# Altium schematic sheet jtagio.SchDoc: JTAG I/O
size A; Engineer: A. Peck; Organization: UCLA High Energy Physics; DocumentNumber: 8; Revision: 3.0; SheetNumber: 8; SheetTotal: 15; Project: LCT Comparator Tester
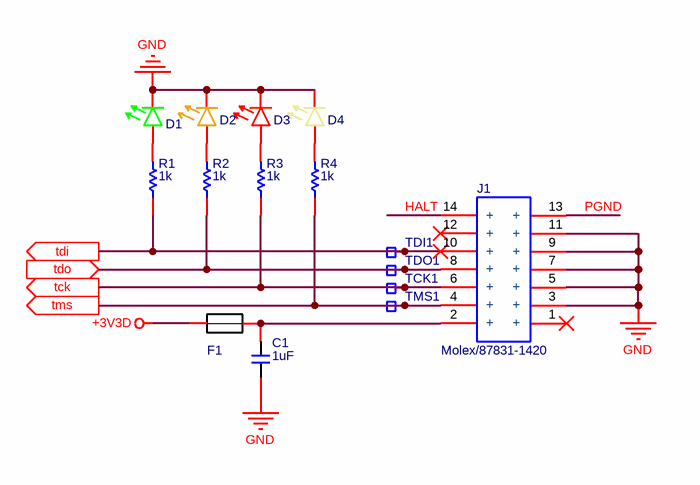
[diagram p0: jtagio.SchDoc]

## Parts
C1  1uF  [C0603]
D1  LITEON/LTST-C191KGKT  [LED0603]  (value not drawn)
D2  Vishay/TLMO1000-GS08  [LED0603]  (value not drawn)
D3  Vishay/TLMS1000-GS08  [LED0603]  (value not drawn)
D4  Vishay/TLMY1000-GS08  [LED0603]  (value not drawn)
F1  Littelfuse/1206L  [R1206]  (value not drawn)
J1  Molex/87831-1420  [Molex Milligrid 7x2]
R1  1k  [R0603]
R2  1k  [R0603]
R3  1k  [R0603]
R4  1k  [R0603]
TCK1  TP  [TP]  (value not drawn)  (no BOM)
TDI1  TP  [TP]  (value not drawn)  (no BOM)
TDO1  TP  [TP]  (value not drawn)  (no BOM)
TMS1  TP  [TP]  (value not drawn)  (no BOM)

## Ports
tck (out), tdi (out), tdo (in), tms (out)

## Nets
+3V3D: F1.1
GND: C1.2 D1.C D2.C D3.C D4.C J1.3(+) J1.5(+) J1.7(+) J1.9(+) J1.11(+)
HALT: J1.14(+)
PGND: J1.13(+)
tck: J1.6(+) R3.1 TCK1.1 ; port tck
tdi: J1.10(+) R1.1 TDI1.1 ; port tdi
tdo: J1.8(+) R2.1 TDO1.1 ; port tdo
tms: J1.4(+) R4.1 TMS1.1 ; port tms
NetC1_1: C1.1 F1.2 J1.2(+)
NetD1_A: D1.A R1.2
NetD2_A: D2.A R2.2
NetD3_A: D3.A R3.2
NetD4_A: D4.A R4.2

Not connected (* = marked no-connect by the designer): J1 1(+)* 12(+)*

## Notes on the sheet
- Date:
- Rev:
- of
- Sheet

## Library data of the parts
C1 = Murata/GRM188R61E105KA12D: CAP-CER, 2, 1.0uF, 10%, 25V, 0603; Manufacturer: Murata Electronics North America; Capacitance: 1µF; Temperature Coefficient: X5R; Supplier 1: Digi-Key; Manufacturer Part Number: GRM188R61E105KA12D; RoHS: RoHS Compliant; Category: Capacitors; Packaging: Cut Tape (CT); Tolerance: ±10%; Voltage - Rated: 25V; Mounting Type: Surface Mount, MLCC; Operating Temperature: -55°C ~ 85°C; Package / Case: 0603 (1608 Metric); Size / Dimension: 0.063" L x 0.031" W (1.60mm x 0.80mm); Height - Seated (Max): -; Lead Spacing: -; Features: -; ComponentLink1URL: http://www.murata.com/~/media/webrenewal/support/library/catalog/products/capacitor/mlcc/c02e.pdf; ComponentLink1Description: http://www.murata.com/~/media/webrenewal/support/library/catalog/products/capacitor/mlcc/c02e.pdf; Supplier Part Number 1: 490-3897-1-ND; Stock 1: 1899119; Pricing 1: 1=0.1, 10=0.036, 50=0.0196, 100=0.0165, 250=0.01352, 500=0.01156, 1000=0.009 (USD); Applications: General Purpose; Ratings: -; Thickness (Max): 0.035" (0.90mm); Lead Style: -
D1 = LITEON/LTST-C191KGKT: LED, 20mA, 0603, Green; Supplier 1: Digi-Key; Supplier Part Number 1: 160-1446-1-ND
D2 = Vishay/TLMO1000-GS08: LED, 2mA, 0603, Soft Orange; Manufacturer: Vishay Semiconductor Opto Division; Millicandela Rating: 7.5mcd; Lens Style/Size: Rectangle with Flat Top, 1.60mm x 0.80mm; Voltage - Forward (Vf) (Typ): 1.8V; Viewing Angle: 160°; Wavelength - Dominant: 605nm; Wavelength - Peak: 610nm; Supplier 1: Digi-Key; Manufacturer Part Number: TLMO1000-GS08; RoHS: RoHS Compliant; Category: Optoelectronics; Stock 1: 182; Pricing 1: 1=0.52, 10=0.372, 25=0.304, 100=0.2432, 250=0.20524, 500=0.17482, 1000=0.13682 (USD); Packaging: Cut Tape (CT); Color: Orange; Lens Color: -; Lens Transparency: -; Current - Test: 2mA; Mounting Type: Surface Mount; Features: -; Package / Case: 0603 (1608 Metric); Supplier Device Package: 0603; Size / Dimension: 1.60mm L x 0.80mm W; Height (Max): 0.65mm; ComponentLink1URL: http://www.vishay.com/docs/83172/tlmo1000.pdf; ComponentLink1Description: http://www.vishay.com/docs/83172/tlmo1000.pdf; Supplier Part Number 1: TLMO1000-GS08CT-ND
D3 = Vishay/TLMS1000-GS08: LED, 2mA, 0603, Red; Manufacturer: Vishay Semiconductor Opto Division; Millicandela Rating: 4mcd; Lens Style/Size: Rectangle with Flat Top, 1.60mm x 0.80mm; Voltage - Forward (Vf) (Typ): 1.8V; Viewing Angle: 160°; Wavelength - Dominant: 628nm; Wavelength - Peak: 640nm; Supplier 1: Digi-Key; Manufacturer Part Number: TLMS1000-GS08; RoHS: RoHS Compliant; Category: Optoelectronics; Stock 1: 12598; Pricing 1: 1=0.52, 10=0.372, 25=0.304, 100=0.2432, 250=0.20524, 500=0.17482, 1000=0.13682 (USD); Packaging: Cut Tape (CT); Color: Red; Lens Color: -; Lens Transparency: -; Current - Test: 2mA; Mounting Type: Surface Mount; Features: -; Package / Case: 0603 (1608 Metric); Supplier Device Package: 0603; Size / Dimension: 1.60mm L x 0.80mm W; Height (Max): 0.65mm; ComponentLink1URL: http://www.vishay.com/docs/83172/tlmo1000.pdf; ComponentLink1Description: http://www.vishay.com/docs/83172/tlmo1000.pdf; Supplier 2: Newark; Supplier Part Number 1: TLMS1000-GS08CT-ND; Supplier Part Number 2: 35M3052
D4 = Vishay/TLMY1000-GS08: LED, 2mA, 0603, Yellow; Manufacturer: Vishay Semiconductor Opto Division; Millicandela Rating: 7.5mcd; Lens Style/Size: Rectangle with Flat Top, 1.60mm x 0.80mm; Voltage - Forward (Vf) (Typ): 1.8V; Viewing Angle: 160°; Wavelength - Dominant: 588nm; Wavelength - Peak: 591nm; Supplier 1: Digi-Key; Manufacturer Part Number: TLMY1000-GS08; RoHS: RoHS Compliant; Category: Optoelectronics; Stock 1: 10152; Pricing 1: 1=0.52, 10=0.372, 25=0.304, 100=0.2432, 250=0.20524, 500=0.17482, 1000=0.13682 (USD); Packaging: Cut Tape (CT); Part Status: Active; Color: Yellow; Lens Color: -; Lens Transparency: -; Current - Test: 2mA; Mounting Type: Surface Mount; Features: -; Package / Case: 0603 (1608 Metric); Supplier Device Package: 0603; Size / Dimension: 1.60mm L x 0.80mm W; Height (Max): 0.65mm; ComponentLink1URL: http://www.vishay.com/docs/83172/tlmo1000.pdf; ComponentLink1Description: http://www.vishay.com/docs/83172/tlmo1000.pdf; Supplier Part Number 1: TLMY1000-GS08CT-ND
F1 = Littelfuse/1206L: FUSE, Resetable, 1206 Generic
J1 = Molex/87831-1420: Header 8x2 2.0mm; Manufacturer: Molex, LLC; Manufacturer Part Number: 0878311420; Connector Type: Header, Shrouded; Number of Positions: 14; Number of Positions Loaded: All; Pitch: 0.079" (2.00mm); Supplier 1: Digi-Key; RoHS: RoHS Compliant; Category: Connectors, Interconnects; Stock 1: 12951; Pricing 1: 1=1.37, 10=1.239, 25=1.1632, 50=1.1126, 100=1.062, 250=0.96084, 500=0.88498, 1000=0.75855, 2500=0.70798 (USD); Packaging: Tube; Part Status: Active; Contact Type: Male Pin; Number of Rows: 2; Row Spacing: 0.079" (2.00mm); Contact Mating Length: 0.141" (3.60mm); Mounting Type: Through Hole; Termination: Solder; Fastening Type: Latch Holder; Features: -; Contact Finish: Gold; Contact Finish Thickness: 15µin (0.38µm); Color: Black; ComponentLink1URL: http://www.molex.com/pdm_docs/sd/878311420_sd.pdf; ComponentLink1Description: http://www.molex.com/pdm_docs/sd/878311420_sd.pdf; Supplier Part Number 1: WM17469-ND
R1-R4 = CRCW06031K00FKEA: RES1, SMD, 1.00k, 1.0%, 1/10W, 0603; Manufacturer: Vishay Dale; Tolerance: ±1%; Power (Watts): 0.1W, 1/10W; Temperature Coefficient: ±100ppm/°C; Supplier 1: Digi-Key; Manufacturer Part Number: CRCW06031K00FKEA; RoHS: RoHS Compliant; Category: Resistors; Stock 1: 770011; Pricing 1: 1=0.1, 10=0.03, 25=0.022, 50=0.0168, 100=0.0123, 250=0.0094, 500=0.00752, 1000=0.00554, 2500=0.00481 (USD); Packaging: Cut Tape (CT); Resistance (Ohms): 1k; Composition: Thick Film; Features: Automotive AEC-Q200; Operating Temperature: -55°C ~ 155°C; Package / Case: 0603 (1608 Metric); Supplier Device Package: 0603; Size / Dimension: 0.061" L x 0.033" W (1.55mm x 0.85mm); Height: 0.020" (0.50mm); Number of Terminations: 2; ComponentLink1URL: http://www.vishay.com/docs/20035/dcrcwe3.pdf; ComponentLink1Description: http://www.vishay.com/docs/20035/dcrcwe3.pdf; Supplier 2: Newark; Supplier Part Number 1: 541-1.00KHCT-ND; Supplier Part Number 2: 52K8015
TCK1 TDI1 TDO1 TMS1 = TP: Test Point, Generic, 100MIL